# EAGLE design MBC3_1-3 (EAGLE 9.6.2)
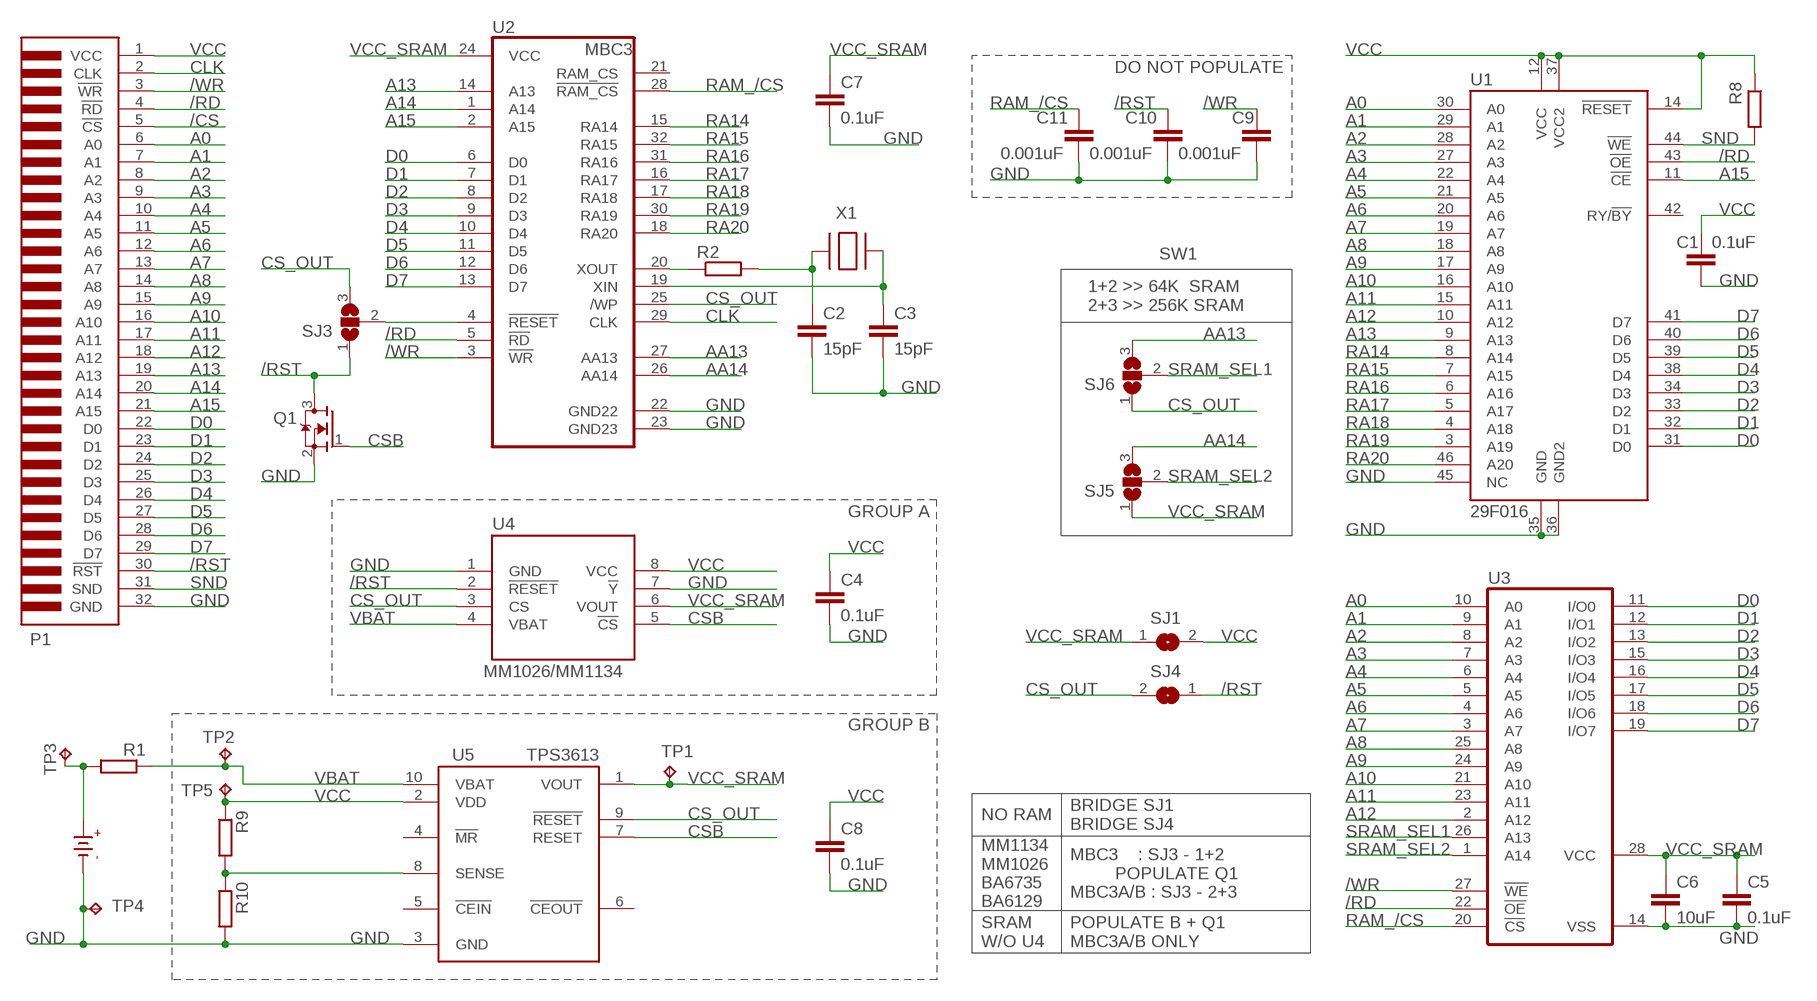
[diagram p0: schematic, sheet 1]

## Parts
B1  CR2025  [CR2025]
C1  0.1uF  C-EUC0603  [C0603]
C2  15pF  C-EUC0603  [C0603]
C3  15pF  C-EUC0603  [C0603]
C4  0.1uF  C-EUC0603  [C0603]
C5  0.1uF  C-EUC0603  [C0603]
C6  10uF  C-EUC0603  [C0603]
C7  0.1uF  C-EUC0603  [C0603]
C8  0.1uF  C-EUC0603  [C0603]
C9  0.001uF  C-EUC0603  [C0603]
C10  0.001uF  C-EUC0603  [C0603]
C11  0.001uF  C-EUC0603  [C0603]
P1  GBC_CART  [GBC_CART]
Q1  2N7002  MOSFET-NREFLOW  [SOT23]
R1  RR0603  [R0603]
R2  RR0603  [R0603]
R8  RR0603  [R0603]
R9  RR0603  [R0603]
R10  RR0603  [R0603]
SJ1  SJ  [SJ]
SJ3  SJ2W  [SJ_2]
SJ4  SJ  [SJ]
SJ5  SJ2W  [SJ_2]
SJ6  SJ2W  [SJ_2]
TP1  TPB1,27  [B1,27]
TP2  TPB1,27  [B1,27]
TP3  TPB1,27  [B1,27]
TP4  TPB1,27  [B1,27]
TP5  TPB1,27  [B1,27]
U1  29F016  [TSOP-48]
U2  MBC3  [QFP-32]
U3  62256_SRAM  [SOP-28L]
U4  MM1134  [SOIC-8]
U5  TPS3613  [MSOP-10]
X1  XTAL-3.2X1.5  [XTAL3215]

## Nets
/CS: P1.5(!CS)
/RD: P1.4(!RD) U1.43(!OE) U2.5(!RD) U3.22(!OE)
/RST: C10.1 P1.30(!RST) Q1.3(D) SJ3.1 SJ4.1 U4.2(!RESET)
/WR: C9.1 P1.3(!WR) U2.3(!WR) U3.27(!WE)
A0: P1.6(A0) U1.30(A0) U3.10(A0)
A1: P1.7(A1) U1.29(A1) U3.9(A1)
A2: P1.8(A2) U1.28(A2) U3.8(A2)
A3: P1.9(A3) U1.27(A3) U3.7(A3)
A4: P1.10(A4) U1.22(A4) U3.6(A4)
A5: P1.11(A5) U1.21(A5) U3.5(A5)
A6: P1.12(A6) U1.20(A6) U3.4(A6)
A7: P1.13(A7) U1.19(A7) U3.3(A7)
A8: P1.14(A8) U1.18(A8) U3.25(A8)
A9: P1.15(A9) U1.17(A9) U3.24(A9)
A10: P1.16(A10) U1.16(A10) U3.21(A10)
A11: P1.17(A11) U1.15(A11) U3.23(A11)
A12: P1.18(A12) U1.10(A12) U3.2(A12)
A13: P1.19(A13) U1.9(A13) U2.14(A13)
A14: P1.20(A14) U2.1(A14)
A15: P1.21(A15) U1.11(!CE) U2.2(A15)
AA13: SJ6.3 U2.27(AA13)
AA14: SJ5.3 U2.26(AA14)
CLK: P1.2(CLK) U2.29(CLK)
CS_OUT: SJ3.3 SJ4.2 SJ6.1 U2.25(/WP) U4.3(CS) U5.9(!RESET)
CSB: Q1.1(G) U4.5(!CS) U5.7(RESET)
D0: P1.22(D0) U1.31(D0) U2.6(D0) U3.11(I/O0)
D1: P1.23(D1) U1.32(D1) U2.7(D1) U3.12(I/O1)
D2: P1.24(D2) U1.33(D2) U2.8(D2) U3.13(I/O2)
D3: P1.25(D3) U1.34(D3) U2.9(D3) U3.15(I/O3)
D4: P1.26(D4) U1.38(D4) U2.10(D4) U3.16(I/O4)
D5: P1.27(D5) U1.39(D5) U2.11(D5) U3.17(I/O5)
D6: P1.28(D6) U1.40(D6) U2.12(D6) U3.18(I/O6)
D7: P1.29(D7) U1.41(D7) U2.13(D7) U3.19(I/O7)
GND [GND]: B1.- C1.2 C2.2 C3.2 C4.2 C5.2 C6.2 C7.2 C8.2 C9.2 C10.2 C11.2 P1.32(GND) Q1.2(S) R10.2 TP4.TP U1.35(GND) U1.36(GND2) U1.45(NC) U2.22(GND22) U2.23(GND23) U3.14(VSS) U4.1(GND) U4.7(!Y) U5.3(GND)
N$1: SJ3.2 U2.4(!RESET)
N$3 [VCC]: B1.+ R1.2 TP3.TP
N$6: R2.1 U2.20(XOUT)
N$7: C2.1 R2.2 X1.P$2
N$8: C3.1 U2.19(XIN) X1.P$1
N$10: R9.2 R10.1 U5.8(SENSE)
RA14: U1.8(A14) U2.15(RA14)
RA15: U1.7(A15) U2.32(RA15)
RA16: U1.6(A16) U2.31(RA16)
RA17: U1.5(A17) U2.16(RA17)
RA18: U1.4(A18) U2.17(RA18)
RA19: U1.3(A19) U2.30(RA19)
RA20: U1.46(A20) U2.18(RA20)
RAM_/CS: C11.1 U2.28(!RAM_CS) U3.20(!CS)
SND: P1.31(SND) R8.2 U1.44(!WE)
SRAM_SEL1: SJ6.2 U3.26(A13)
SRAM_SEL2: SJ5.2 U3.1(A14)
VBAT [VCC]: R1.1 TP2.TP U4.4(VBAT) U5.10(VBAT)
VCC [VCC]: C1.1 C4.1 C8.1 P1.1(VCC) R8.1 R9.1 SJ1.2 TP5.TP U1.12(VCC) U1.14(!RESET) U1.37(VCC2) U4.8(VCC) U5.2(VDD)
VCC_SRAM [VCC]: C5.1 C6.1 C7.1 SJ1.1 SJ5.1 TP1.TP U2.24(VCC) U3.28(VCC) U4.6(VOUT) U5.1(VOUT)
Unconnected: U1.42(RY/!BY) U2.21(RAM_CS) U5.4(!MR) U5.5(!CEIN) U5.6(!CEOUT)

## Notes on the sheet
- DO NOT POPULATE
- SW1
- 1+2 >> 64K  SRAM
  2+3 >> 256K SRAM
- GROUP A
- MM1026/MM1134
- GROUP B
- NO RAM
- BRIDGE SJ1
  BRIDGE SJ4
- MM1134
  MM1026
  BA6735
  BA6129
- MBC3    : SJ3 - 1+2
           POPULATE Q1
  MBC3A/B : SJ3 - 2+3
- SRAM
  W/O U4
- POPULATE B + Q1
  MBC3A/B ONLY

## Library data of the parts
B1 = gameboylib:CR2025
C1-C11 = rcl:C-EU: CAPACITOR, European symbol; SPICEPREFIX: C
P1 = gameboylib:GBC_CART
Q1 = adafruit:MOSFET-N: N-Channel Mosfet 2N7002E - 60V 260mA SOT23 [Digikey: 2N7002ET1GOSTR-ND] - REEL BSH103 - 30V 850mA SOT23 [Digikey: 568-5013-1-ND]
R1 R2 R8-R10 = eagle-ltspice:R: RESISTOR, European symbol; SPICEMODEL: NONE; SPICEPREFIX: R
SJ1 SJ4 = jumper:SJ: SMD solder JUMPER
SJ3 SJ5 SJ6 = jumper:SJ2W: SMD solder JUMPER
TP1-TP5 = testpad:TP: Test pad
U1 = gameboylib:29F016
U2 = gameboylib:MBC3: MBC3; OC_FARNELL: unknown; OC_NEWARK: unknown
U3 = gameboylib:62256_SRAM: MEMORY; MPN: CY62256VNLL-70SNXI; OC_FARNELL: 1650073; OC_NEWARK: 19M2582
U4 = gameboylib:MM1134
U5 = gameboylib:TPS3613
X1 = adafruit:XTAL: Low cost SMT crystals, no capacitors included http://www.ladyada.net/library/eagle

## Net classes
1 VCC: width 0.203 mm
2 GND: width 0.203 mm

## Board
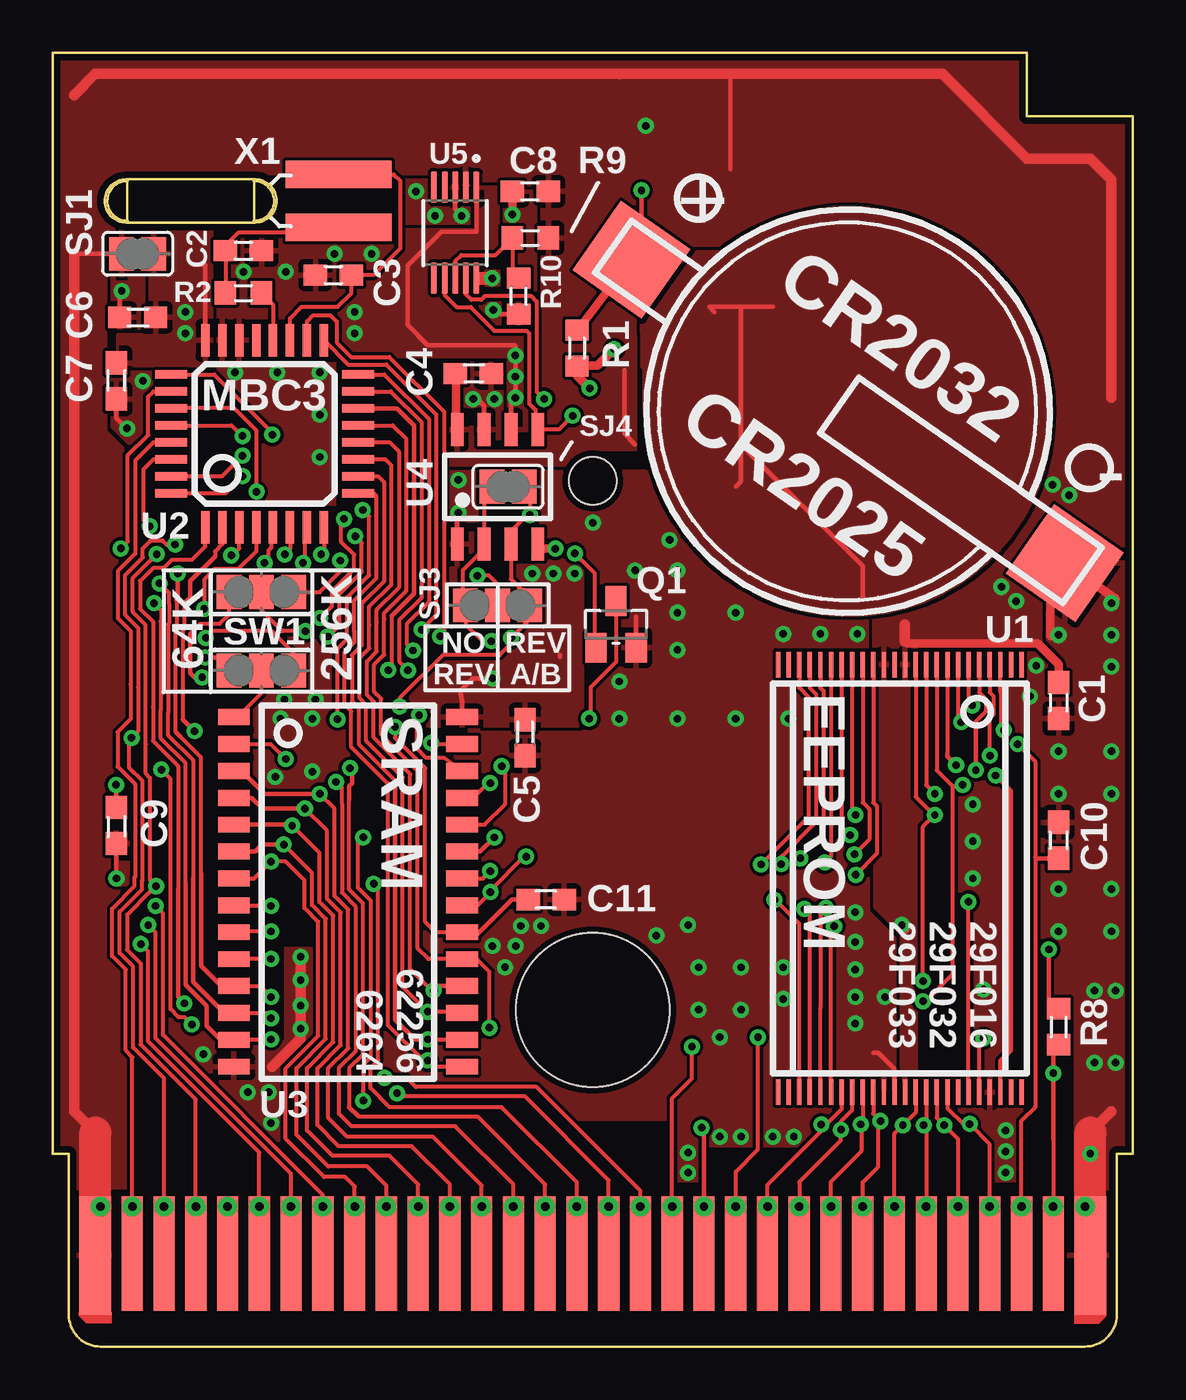
[diagram p1: board, top side]
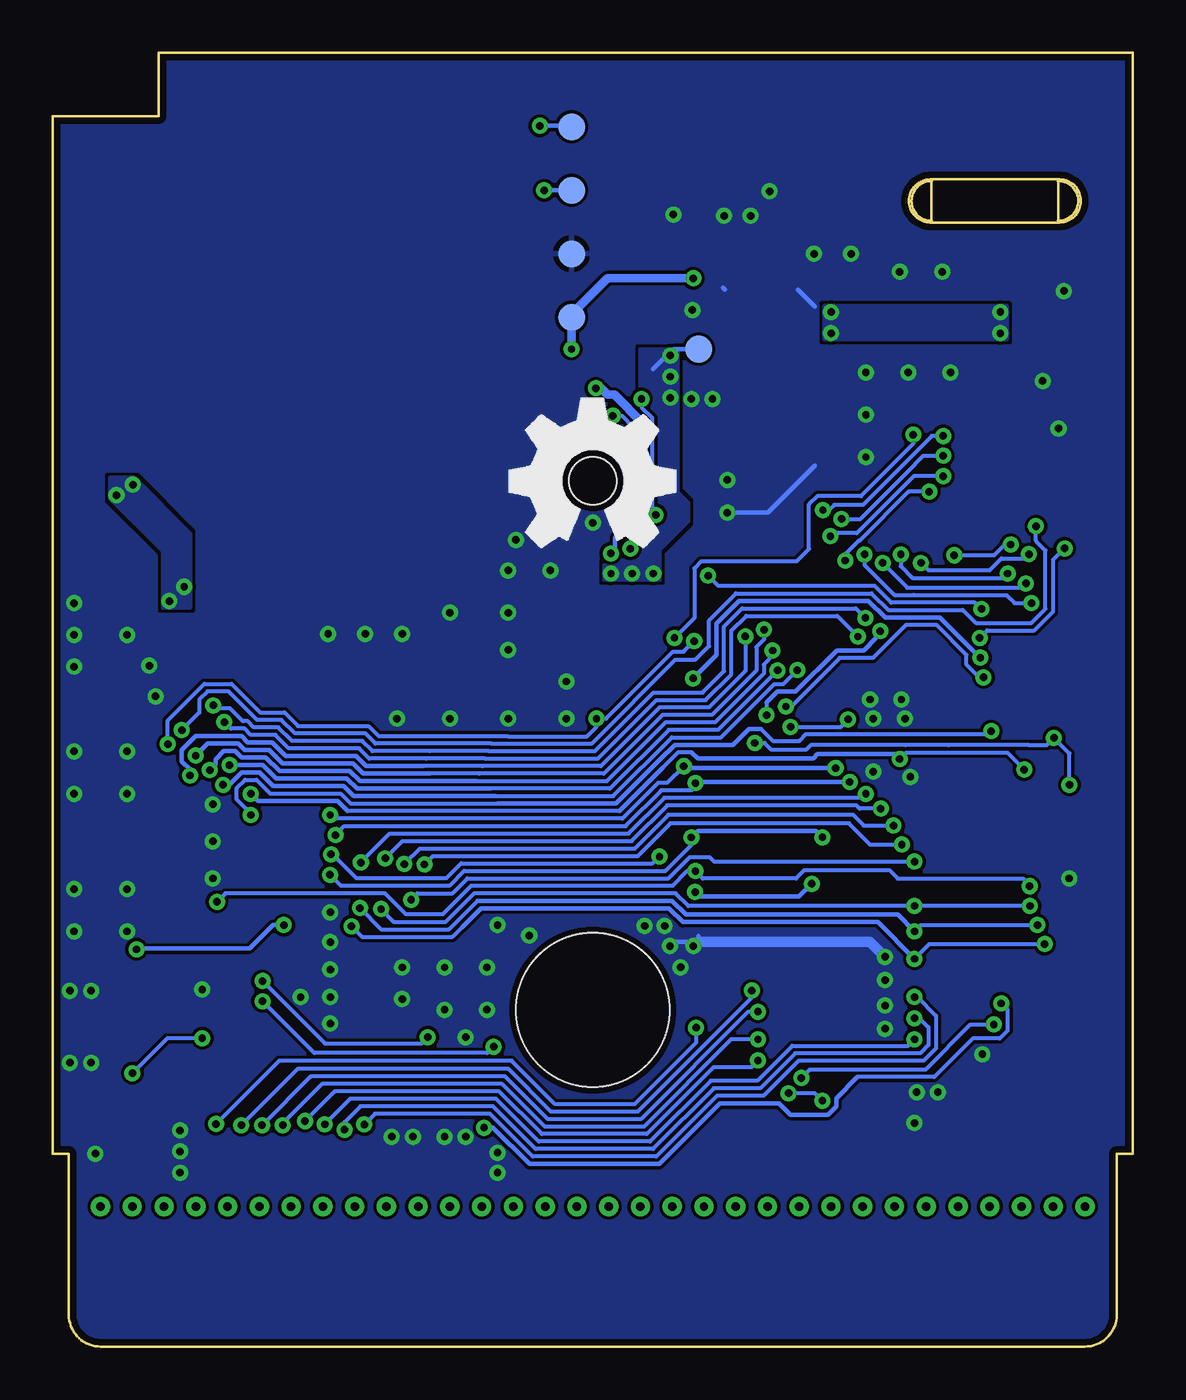
[diagram p2: board, bottom side, seen from below]

Size 51 x 61.1 mm. Coordinates in mm from the lower left corner, seen from the top.
Copper layers (1*16): Top 0.035mm / dielectric 1.5mm / Bottom 0.035mm
Design rules "default *": minimum track width 7mil, minimum drill 13mil, track to track 6mil, track to pad 7mil, pad to pad 7mil, via to via 7mil, smd to smd 5mil, copper to edge 12mil, drill to drill 22mil, minimum pad ring 10mil, minimum via ring 8mil, stop-mask expansion 4mil, vias tented up to drill 14mil, thermal gap 10mil
tKeepout: area -1.8,-1.5 to 54,11.1; area -1,11.1 to 2,62.1; area 49,11.1 to 52,62.1; area 2,55.2 to 49,62.1
tRestrict: area 30.8,8.8 to 35.4,9.3; area 47.4,5.6 to 48.1,15.7; area 10.2,14.5 to 10.8,20.8; area 9.6,21.1 to 10.3,22.5; area 46.6,0.8 to 49.9,1.3; area 9.5,39.1 to 13.5,39.6; area 13.5,39.6 to 14,46.6; area 9.1,46.6 to 13.5,47.1; area 8.3,46.6 to 8.5,48.4; area 9.1,48.2 to 10.9,48.4; area 26.6,6.8 to 33.9,7.7; area 37.8,11.3 to 42.4,12.1; area 34.1,32.4 to 38.8,32.9; area 45.1,31.5 to 45.9,32.1; area 34.1,31.5 to 34.9,32.1; area 34.1,12 to 39,12.7; area 10.8,19 to 12.2,19.7; area 25.6,41.6 to 27.9,42.2; area 25.6,41.5 to 28.1,41.7; area 24.2,10.1 to 28.9,10.6; area 44.6,7.3 to 45.4,7.7; area 2.5,24.5 to 3.1,24.8; area 8.7,29 to 9.4,29.2; area 8.7,27.7 to 9.4,28; area 20.8,42.5 to 21.2,42.7; area 22.1,42.5 to 22.4,42.7; area 19.5,44 to 19.9,44.2; area 19.5,38.6 to 19.9,38.8; area 22.1,37.1 to 22.5,37.3

### Footprints (pad centres in the part's own frame; a part is rotated, then mirrored left to right if it is on the bottom)
CR2025 = smd 4 x 4: + -12,0; - 13,0
C0603 = smd 1.1 x 1: 1 -0.85,0; 2 0.85,0
GBC_CART = smd 1.5 x 5.6: 1 -23.4,-25.01; 32 23.6,-25.01 | smd 1 x 5.4: 2 -21.65,-24.91; 3 -20.15,-24.91; 4 -18.65,-24.91; 5 -17.15,-24.91; 6 -15.65,-24.91; 7 -14.15,-24.91; 8 -12.65,-24.91; 9 -11.15,-24.91; 10 -9.65,-24.91; 11 -8.15,-24.91; 12 -6.65,-24.91; 13 -5.15,-24.91; 14 -3.65,-24.91; 15 -2.15,-24.91; 16 -0.65,-24.91; 17 0.85,-24.91; 18 2.35,-24.91; 19 3.85,-24.91; 20 5.35,-24.91; 21 6.85,-24.91; 22 8.35,-24.91; 23 9.85,-24.91; 24 11.35,-24.91; 25 12.85,-24.91; 26 14.35,-24.91; 27 15.85,-24.91; 28 17.35,-24.91; 29 18.85,-24.91; 30 20.35,-24.91; 31 21.85,-24.91 | drill 0.4: P$1 -21.65,-22.7; P$2 -18.65,-22.7; P$3 -15.65,-22.7; P$4 -12.65,-22.7; P$5 -9.65,-22.7; P$6 -6.65,-22.7; P$7 -3.65,-22.7; P$8 -0.65,-22.7; P$9 2.35,-22.7; P$10 5.35,-22.7; P$11 8.35,-22.7; P$12 11.35,-22.7; P$13 14.35,-22.7; P$14 17.35,-22.7; P$15 20.35,-22.7; P$16 23.35,-22.7; P$17 21.85,-22.7; P$18 18.85,-22.7; P$19 15.85,-22.7; P$20 12.85,-22.7; P$21 9.85,-22.7; P$22 6.85,-22.7; P$23 3.85,-22.7; P$24 0.85,-22.7; P$25 -2.15,-22.7; P$26 -5.15,-22.7; P$27 -8.15,-22.7; P$28 -11.15,-22.7; P$29 -14.15,-22.7; P$30 -17.15,-22.7; P$31 -20.15,-22.7; P$32 -23.15,-22.7 | hole 7.25: 0.1,-13.41 | hole 2.25: 0.1,11.585
SOT23 = smd 1 x 1.4: 1 -0.95,-1.1; 2 0.95,-1.1; 3 0,1.1
R0603 = smd 1 x 1.1: 1 -0.85,0; 2 0.85,0
SJ = smd 1.168 x 1.6: 1 -0.762,0; 2 0.762,0
SJ_2 = smd 1.168 x 1.6: 1 -1.524,0; 2 0,0; 3 1.524,0
B1,27 = smd 1.27 x 1.27: TP 0,0
TSOP-48 = smd 1.2 x 0.21: 1 -10.1,5.75; 2 -10.1,5.25; 3 -10.1,4.75; 4 -10.1,4.25; 5 -10.1,3.75; 6 -10.1,3.25; 7 -10.1,2.75; 8 -10.1,2.25; 9 -10.1,1.75; 10 -10.1,1.25; 11 -10.1,0.75; 12 -10.1,0.25; 13 -10.1,-0.25; 14 -10.1,-0.75; 15 -10.1,-1.25; 16 -10.1,-1.75; 17 -10.1,-2.25; 18 -10.1,-2.75; 19 -10.1,-3.25; 20 -10.1,-3.75; 21 -10.1,-4.25; 22 -10.1,-4.75; 23 -10.1,-5.25; 24 -10.1,-5.75; 25 10.1,-5.75; 26 10.1,-5.25; 27 10.1,-4.75; 28 10.1,-4.25; 29 10.1,-3.75; 30 10.1,-3.25; 31 10.1,-2.75; 32 10.1,-2.25; 33 10.1,-1.75; 34 10.1,-1.25; 35 10.1,-0.75; 36 10.1,-0.25; 37 10.1,0.25; 38 10.1,0.75; 39 10.1,1.25; 40 10.1,1.75; 41 10.1,2.25; 42 10.1,2.75; 43 10.1,3.25; 44 10.1,3.75; 45 10.1,4.25; 46 10.1,4.75; 47 10.1,5.25; 48 10.1,5.75
QFP-32 = smd 0.4 x 1.524: 1 -2.8,-4.415; 2 -2,-4.415; 3 -1.2,-4.415; 4 -0.4,-4.415; 5 0.4,-4.415; 6 1.2,-4.415; 7 2,-4.415; 8 2.8,-4.415; 17 2.8,4.415; 18 2,4.415; 19 1.2,4.415; 20 0.4,4.415; 21 -0.4,4.415; 22 -1.2,4.415; 23 -2,4.415; 24 -2.8,4.415 | smd 1.524 x 0.4: 9 4.415,-2.8; 10 4.415,-2; 11 4.415,-1.2; 12 4.415,-0.4; 13 4.415,0.4; 14 4.415,1.2; 15 4.415,2; 16 4.415,2.8; 25 -4.415,2.8; 26 -4.415,2; 27 -4.415,1.2; 28 -4.415,0.4; 29 -4.415,-0.4; 30 -4.415,-1.2; 31 -4.415,-2; 32 -4.415,-2.8
SOP-28L = smd 0.75 x 1.5: 1 -7.62,-5.457; 2 -6.35,-5.457; 3 -5.08,-5.457; 4 -3.81,-5.457; 5 -2.54,-5.457; 6 -1.27,-5.457; 7 0,-5.457; 8 1.27,-5.457; 9 2.54,-5.457; 10 3.81,-5.457; 11 5.08,-5.457; 12 6.35,-5.457; 13 7.62,-5.457; 14 8.89,-5.457; 15 8.89,5.33; 16 7.62,5.33; 17 6.35,5.33; 18 5.08,5.33; 19 3.81,5.33; 20 2.54,5.33; 21 1.27,5.33; 22 0,5.33; 23 -1.27,5.33; 24 -2.54,5.33; 25 -3.81,5.33; 26 -5.08,5.33; 27 -6.35,5.33; 28 -7.62,5.33
SOIC-8 = smd 0.6 x 1.55: 1 1.905,2.7; 2 0.635,2.7; 3 -0.635,2.7; 4 -1.905,2.7; 5 -1.905,-2.7; 6 -0.635,-2.7; 7 0.635,-2.7; 8 1.905,-2.7
MSOP-10 = smd 1.47 x 0.28: 1 -2.15,1; 2 -2.15,0.5; 3 -2.15,0; 4 -2.15,-0.5; 5 -2.15,-1; 6 2.15,-1; 7 2.15,-0.5; 8 2.15,0; 9 2.15,0.5; 10 2.15,1
XTAL3215 = smd 1.3 x 5: P$1 1.25,0.5; P$2 -1.25,0.5

### Placement (x,y rotation side)
B1  37.15,44.46 325 top
C1  47.5,30.51 270 top
C2  9,51.76 0 top
C3  13.25,50.61 180 top
C4  19.85,45.96 0 top
C5  22.3,28.76 270 top
C6  4,48.61 180 top
C7  3,45.61 270 top
C8  22.55,54.56 180 top
C9  3,24.61 270 top
C10  47.5,23.91 90 top
C11  23.3,21.11 0 top
P1  25.4,29.31 0 top
Q1  26.6,34.11 0 top
R1  24.75,47.16 90 top
R2  9,49.76 180 top
R8  47.5,15.11 270 top
R9  22.55,52.36 180 top
R10  22,49.61 270 top
SJ1  4,51.61 180 top
SJ3  21,35.01 0 top
SJ4  21.5,40.61 0 top
SJ5  9.85,31.93 0 top
SJ6  9.85,35.63 0 top
TP1  20.5,47.11 0 bottom
TP2  26.5,48.61 0 bottom
TP3  26.5,54.61 0 bottom
TP4  26.5,51.61 0 bottom
TP5  26.5,57.61 0 bottom
U1  40,22.11 270 top
U2  10,43.11 0 top
U3  14,22.11 270 top
U4  21,40.61 180 top
U5  19,52.61 270 top
X1  14,54.11 90 top

### Tracks (layer width: path | path; a pad name or v marks a point on that pad's centre or on a via)
/RD  (via drill 0.35)
  Top 0.2: P1.4 6.75,11.66 4.14,14.27 4.14,18.09 3.5,18.74 3.5,20.39 4.58,21.47 4.59,21.47 v4.87,21.74 4.58,22.03 4.58,26.86 4.38,27.06 4.38,28.45 4.37,28.46 4.37,30.98 4.38,30.99 4.38,34.09 3.77,34.7 3.77,36.3 4.58,37.12 4.6,37.12 v4.9,37.42 v4.89,37.43 | U3.22 20.3,22.11 v20.65,22.46 | U2.5 10.3,38.59 10.3,37.72 10.17,37.59 10.17,37.19 v9.99,37.02 | U1.43 v43.25,21.01
  Bottom 0.2: v4.87,21.74 4.87,21.81 5.17,22.11 11.1,22.11 11.5,22.51 15.5,22.51 15.9,22.11 20.3,22.11 v20.65,22.46 21.05,22.46 21.75,21.76 31.25,21.76 32.59,20.42 34.33,20.42 35.32,21.41 42.85,21.41 v43.25,21.01 | v4.9,37.42 5.1,37.22 6.2,37.22 6.75,36.67 9.64,36.67 v9.99,37.02
/RST  (via drill 0.35)
  Top 0.2: P1.30 45.75,10.67 46.39,11.31 46.39,23.12 46.39,27.63 v45.57,28.45 46.15,27.87 | v20.71,33.32 20.29,33.32 19.5,34.11 19.5,34.99 SJ3.1 19.35,35.14 19.35,36.66 20.36,37.67 U4.2 20.36,40.24 SJ4.1 | Q1.3 26.6,32.34 25.4,31.13 25.4,29.73 v25.32,29.65
  Top 0.203: C10.1 46.45,23.06 46.39,23.12
  Bottom 0.2: v45.57,28.45 45.57,29.57 43.85,31.3 42.56,31.3 41.22,29.95 40.06,29.95 39.42,29.31 36.1,29.31 35.62,28.83 29.52,28.83 29.51,28.82 25.78,28.82 25.32,29.27 v25.32,29.65 24.87,29.65 21.71,32.82 21.21,32.82 v20.71,33.32
/WR  (via drill 0.35)
  Top 0.2: v17.85,28.51 17.9,28.46 U3.27 | P1.3 5.25,12.67 3.79,14.13 3.79,17.95 3.15,18.59 3.15,20.53 4.21,21.6 4.21,22.02 4.23,22.03 4.23,26.72 3.61,27.34 3.61,28.65 v3.71,28.75 4.02,29.06 4.02,31.13 4.02,33.94 3.42,34.55 3.42,36.45 4.24,37.28 4.24,37.69 4.63,38.08 5.17,38.08 5.37,37.88 v5.76,37.88 | U2.3 8.8,37.7 8.45,37.35 v8.43,37.37
  Top 0.203: C9.1 2.98,25.48 v2.98,26.53
  Bottom 0.2: 17.85,28.46 v17.85,28.51 17.39,28.51 17.09,28.21 15.4,28.21 15.2,28.41 10.73,28.41 10.72,28.41 8.7,28.41 4.89,28.41 | v5.76,37.88 6.04,37.88 6.55,37.37 v8.43,37.37 | v2.98,26.53 2.98,28.02 v3.71,28.75 4.06,28.41 4.89,28.41 | 4.89,28.41
A0  (via drill 0.35)
  Top 0.2: P1.6 9.75,9.16 4.5,14.42 4.5,18.67 v4.16,19.01 | v10.3,18.31 8.8,18.31 U3.10 | v36.9,19.85 36.75,19.7 U1.30
  Bottom 0.2: v10.3,18.31 9.6,19.01 v4.16,19.01 | v36.9,19.85 36.4,19.35 32.13,19.35 31.69,19.8
  Bottom 0.203: v10.3,18.31 12.04,20.05 21.25,20.05 21.9,20.7 30.78,20.7 31.69,19.8
A1  (via drill 0.35)
  Top 0.2: v10.3,19.61 8.83,19.61 U3.9 | v36.5,20.71 36.24,20.45 36.24,15.98 36.25,15.98 U1.29 | P1.7 11.25,8.16 4.85,14.56 4.85,18.91 4.85,19.56 v4.5,19.91
  Bottom 0.2: v10.3,19.61 10,19.91 v4.5,19.91 | v36.5,20.71 35.5,19.71 32.3,19.71 30.95,21.06 30,21.06
  Bottom 0.203: v10.3,19.61 11.1,20.41 21.1,20.41 21.75,21.06 30,21.06 30.95,21.06
A2  (via drill 0.35)
  Top 0.2: P1.8 12.75,7.16 5.2,14.71 5.2,16.63 5.2,20.46 v4.85,20.81 | v10.3,20.81 8.82,20.81 U3.8 | v35.5,20.67 35.56,20.67 35.75,20.48 U1.28
  Bottom 0.2: v4.85,20.81 v10.3,20.81 20.98,20.81 21.58,21.41 31.1,21.41 32.44,20.07 34.9,20.07 v35.5,20.67
A3  (via drill 0.35)
  Top 0.2: P1.9 14.25,7.56 13.8,8.01 12.8,8.01 11,9.81 11,13.15 12.53,14.68 12.53,20.06 11.89,20.71 11.89,22.02 11,22.91 v10.3,22.91 9.5,22.11 U3.7 | v34.09,21.11 34.12,21.11 35.25,19.97 U1.27
  Bottom 0.2: v34.09,21.11 33.78,21.41 32.13,21.41 31.43,22.11 21.92,22.11 20.92,23.12 19.98,23.12 19.77,22.91 v10.3,22.91
A4  (via drill 0.35)
  Top 0.2: P1.10 15.75,7.6 14.84,8.51 13,8.51 11.5,10.01 11.5,13.15 12.89,14.53 12.89,20.21 12.24,20.85 12.24,22.37 v10.9,23.71 | v33.45,22.77 35.69,25.01 35.69,30.68 35.25,31.12 U1.22
  Top 0.203: U3.6 9.54,23.38 9.87,23.71 v10.9,23.71
  Bottom 0.2: 10.8,23.61 v10.9,23.71 12.4,23.71 13.4,24.71 21.83,24.71 23.37,23.17 33.05,23.17 v33.45,22.77
A5  (via drill 0.35)
  Top 0.2: P1.11 17.25,7.66 15.9,9.01 13.2,9.01 12,10.21 12,13.15 13.24,14.39 13.24,20.35 12.59,21 12.59,23.32 v11.3,24.61 | v34.41,22.79 34.41,23.14 36.05,24.77 36.05,30.82 35.75,31.12 U1.21
  Top 0.203: U3.5 11.26,24.65 v11.3,24.61
  Bottom 0.2: v11.3,24.61 12.7,24.61 13.2,25.11 21.93,25.11 23.52,23.52 33.67,23.52 v34.41,22.79
A6  (via drill 0.35)
  Top 0.2: P1.12 18.75,7.66 16.95,9.46 13.5,9.46 12.5,10.46 12.5,13.15 13.59,14.24 13.59,20.5 12.94,21.15 12.94,24.37 v11.9,25.41 | v35.31,23.06 35.31,23.16 36.4,24.25 36.4,30.97 36.25,31.11 U1.20
  Top 0.203: U3.4 9.39,25.92 9.9,25.41 v11.9,25.41
  Bottom 0.2: v11.9,25.41 12.9,25.41 13.06,25.57 21.97,25.57 23.66,23.88 34.49,23.88 v35.31,23.06
A7  (via drill 0.35)
  Top 0.2: P1.13 20.25,7.61 17.95,9.91 13.9,9.91 13,10.81 13,13.15 13.94,14.09 13.94,20.64 13.29,21.29 13.29,25.41 v12.6,26.11 | v36.46,22.86 36.75,23.15 U1.19
  Top 0.203: U3.3 8.92,27.19 10,26.11 v12.6,26.11
  Bottom 0.2: v12.6,26.11 12.79,25.92 22.12,25.92 23.81,24.23 35.09,24.23 v36.46,22.86
A8  (via drill 0.35)
  Top 0.2: P1.14 21.75,7.66 19,10.41 14.1,10.41 13.5,11.01 13.5,13.15 14.29,13.95 14.29,20.79 13.65,21.44 13.65,25.66 13.65,26.38 v13.37,26.67 | U3.25 19.85,25.92 20.55,26.62 v20.65,26.62 | v37.66,24.16 37.25,24.57 U1.18
  Bottom 0.2: 20,26.67 20.44,26.67 20.84,26.27 22.27,26.27 23.95,24.58 37.23,24.58 v37.66,24.16
  Bottom 0.203: v13.37,26.67 20,26.67 20.6,26.67 v20.65,26.62
A9  (via drill 0.35)
  Top 0.2: P1.15 23.25,7.66 20.05,10.86 14.45,10.86 | U3.24 20.39,24.65 21.35,25.61 21.35,27.26 v21.2,27.41 | 14,11.34 14,13.16 14.65,13.8 14.65,20.94 14,21.58 14,26.11 | v37.91,25.11 37.75,25.27 U1.17
  Top 0.203: 14,25.81 14,26.11 14,26.47 14.12,26.59 14.12,27.23 v14.03,27.32 | 14,11.34 14,11.31 14.45,10.86
  Bottom 0.2: v21.2,27.41 21.99,26.62 22.41,26.62 24.1,24.93 37.73,24.93 v37.91,25.11
  Bottom 0.203: v14.03,27.32 21.11,27.32 v21.2,27.41
A10  (via drill 0.35)
  Top 0.2: P1.16 24.75,7.76 21.2,11.31 15.9,11.31 15,12.21 15,13.16 15.36,13.52 15.36,21.65 v15.16,21.85 | U3.21 19.09,20.85 20.07,20.85 20.66,21.45 | v22.35,23.14 22.26,23.14 20.66,21.55 v20.66,21.47 | v37.86,23.25 38.56,23.95 38.56,25.38 38.25,25.69 U1.16
  Top 0.203: v20.66,21.47 20.66,21.45
  Bottom 0.2: v22.35,23.14 22.67,22.82 31.72,22.82 32.42,22.11 36.66,22.11 37.79,23.25 v37.86,23.25
  Bottom 0.203: v15.16,21.85 15.76,21.25 20.46,21.25 20.46,21.27 v20.66,21.47
A11  (via drill 0.35)
  Top 0.2: P1.17 26.25,7.86 22.3,11.81 16.41,11.81 v16.26,11.97 | v37.92,22.28 38.91,23.28 38.91,25.53 38.75,25.69 U1.15 | v14.66,24.05 14.66,24.03 14.4,23.78 14.4,21.68 15,21.08 15,13.66 14.65,13.3 14.65,12.06 14.66,12.06 v14.66,11.61
  Top 0.203: U3.23 20.19,23.38 v20.85,24.04
  Bottom 0.2: v14.66,11.61 15.01,11.97 v16.26,11.97 | v37.92,22.28 37.4,21.76 32.27,21.76 31.57,22.47 22.07,22.47 20.85,23.69 v20.85,24.04
  Bottom 0.203: v14.66,24.05 14.96,24.36 20.54,24.36 v20.85,24.04
A12  (via drill 0.35)
  Top 0.2: P1.18 27.75,7.36 22.85,12.26 17.13,12.26 16.7,12.69 v15.66,12.69 | U3.2 10.29,28.46 v11,27.75 | v41.66,26.11 41.25,26.52 U1.10 | v6.56,15.21 6.21,15.55 5.94,15.55 5.55,15.94 5.55,16.48 5.56,16.48 5.56,26.82 v5.12,27.25
  Bottom 0.2: v15.66,12.69 15.26,13.09 9.78,13.09 7.66,15.21 v6.56,15.21 | 11.23,27.98 v11,27.75 10.7,28.05 5.92,28.05 v5.12,27.25 | 22.18,27.36 21.47,28.07 20.83,28.07 | 24.25,25.29 37.08,25.29
  Bottom 0.203: 11.23,27.98 14.88,27.98 15.08,27.78 20.54,27.78 20.83,28.07 | 22.18,27.36 24.25,25.29 | v41.66,26.11 41.31,25.77 37.56,25.77 37.08,25.29
A13  (via drill 0.35)
  Top 0.2: P1.19 29.25,11.73 30.18,12.67 v30.18,14.17 | v41.1,16.31 41.23,16.31 42.51,17.59 42.51,26.45 41.75,27.22 U1.9 | 16,34.51 16,32.11 v15.84,31.95
  Top 0.203: 42.51,26.45 42.89,26.45 v42.97,26.53 | U2.14 16.25,44.31 17.05,43.51 17.05,35.56 16,34.51
  Bottom 0.2: v30.18,14.17 30.49,13.86 38.65,13.86 v41.1,16.31 | 30.1,26 29.85,26 24.54,26 21.77,28.78 19.44,28.78 16.93,31.29 16.5,31.29 v15.84,31.95
  Bottom 0.203: v42.97,26.53 42.66,26.53 42.07,27.12 41.24,27.12 40.59,26.48 37.27,26.48 36.79,26 30.1,26
A14  (via drill 0.35)
  Top 0.2: 5.91,16.51 v6.21,16.21 | 5.91,21.64 5.91,27.42 4.72,28.6 4.72,30.2 4.73,30.2 4.73,34.24 4.12,34.84 4.12,36.16 4.73,36.77 5.23,36.77 5.63,37.17 6.57,37.17 7.2,37.8 U2.1
  Top 0.203: P1.20 30.75,10.22 v30.64,10.34 | 5.91,16.51 5.91,21.64
  Bottom 0.2: 13,12.73 9.38,12.73 7.56,14.55 6.28,14.55 5.9,14.94 5.9,15.9 v6.21,16.21
  Bottom 0.203: v30.64,10.34 30.61,10.36 30.23,10.36 28.49,8.62 22.36,8.62 19.49,11.49 16.71,11.49 16.17,10.95 14.38,10.95 14,11.34 14,11.73 13,12.73
A15  (via drill 0.35)
  Top 0.2: P1.21 32.25,8.26 33.3,9.31 v33.3,14.61 | 41.6,25.11 40.75,25.96 U1.11 | 41.6,25.11 41.6,25.06 41.1,24.56 v41.1,17.26 | 41.6,25.11 v41.66,25.11 | U2.2 8,37.9 7.66,37.55 7.66,37.34 | 6.49,35.41 6.19,35.11 6.19,33.87 6.14,33.82 6.14,29.62 6.14,29.61
  Top 0.203: 7.66,37.34 7.66,37.32 6.49,36.15 6.49,35.41 | 6.14,29.61 v6.69,29.07
  Bottom 0.2: v41.1,17.26 38.15,14.31 33.6,14.31 v33.3,14.61 | v41.66,25.11 41.66,25.18 42.31,25.84 42.31,26.38 41.93,26.77 41.38,26.77 40.74,26.12 37.42,26.12 36.94,25.64 30,25.64 | 17.55,29.17 17,28.61 15.74,28.61 15.44,28.92 6.83,28.92 v6.69,29.07
  Bottom 0.203: 17.55,29.17 18.12,29.17 18.87,28.42 21.62,28.42 22.32,27.72 24.4,25.64 29.7,25.64 30,25.64
AA13  (via drill 0.35)
  Top 0.2: v13.57,37.12 13.57,36.61 12.6,35.63 SJ6.3 | U2.27 8.57,44.32 9.61,43.28 v9.61,40.38 v9.61,40.37
  Bottom 0.2: v9.61,40.37 10.58,40.37 12.89,38.07 12.94,38.07 13.57,37.43 v13.57,37.12
AA14  (via drill 0.35)
  Top 0.2: SJ5.3 11.36,31.95 11.36,32.76 10.33,33.79 7.53,33.79 v7.22,33.48 | U2.26 4.75,45.11 4.5,44.86 4.5,43.06 3.54,42.1 3.54,38.02 v3.21,37.7
  Bottom 0.2: v7.22,33.48 6.87,33.83 4.64,33.83 3.76,34.7 3.76,37.14 v3.21,37.7
CLK
  Top 0.2: P1.2 3.75,13.67 3.44,13.98 3.44,17.8 2.79,18.45 2.79,20.68 3.86,21.75 3.86,22.16 3.88,22.18 3.88,26.57 3.06,27.39 3.06,29.02 3.67,29.64 3.67,31.27 3.67,31.28 3.67,33.8 3.06,34.41 3.06,36.62 3.89,37.45 3.89,41.85 4.75,42.71 U2.29
CS_OUT  (via drill 0.35)
  Top 0.2: 21.64,38.51 U4.3 | 22.52,35.44 22.52,35.36 | 22.52,35.36 SJ3.3 22.52,34.36 v21.64,33.48 21.64,33.21 21.1,32.66 18.42,32.66 16.38,30.62 v16.38,30.23 | U2.25 7.63,45.91 10.36,43.17 v10.36,43.07 | U4.3 21.64,38.52 22.43,39.32 22.43,39.36 22.45,39.36 v22.53,39.28 22.53,40.34 SJ4.2 | v23.2,44.76 22.85,45.11 22.85,49.36 22.6,49.61 20.4,49.61 20.23,49.45 19.77,49.45 19.5,49.71 U5.9 | U4.3 21.64,36.25 22.52,35.36 | 6.49,33.53 6.49,33.67 6.96,34.14 7.88,34.14 8.33,34.59 8.33,35.36
  Top 0.203: 8.33,35.36 SJ6.1 | 6.49,33.53 6.49,31.81 6.7,31.61 v7.05,31.61
  Bottom 0.2: v10.36,43.07 10.36,42.64 12.83,40.17 14.9,40.17 15.29,39.78 15.29,37.67 15.88,37.08 20.38,37.08 20.71,36.75 20.71,34.41 v21.64,33.48 | v7.05,31.61 7.25,31.61 7.85,32.21 7.85,32.67 9.26,34.08 10.71,34.08 12.27,32.52 13.83,32.52 16.12,30.23 v16.38,30.23 | v22.53,39.28 22.69,39.44 22.69,43.85 23.2,44.36 v23.2,44.76
CSB  (via drill 0.35)
  Top 0.2: Q1.1 25.57,33.09 25.57,36.53 v24.65,37.46 | v24.55,43.96 23.9,43.31 U4.5 22.8,43.31 22.8,44.23 22.5,44.53 22.5,47.86 22.38,47.98 20.84,47.98 19.73,49.09 19.07,49.09 18.5,49.66 U5.7
  Bottom 0.2: v24.55,43.96 24.13,43.96 23.6,43.43 23.6,40.06
  Bottom 0.203: v24.65,37.46 24.45,37.66 24.45,38.21 24.1,38.56 24.1,39.56 23.6,40.06
D0  (via drill 0.35)
  Top 0.2: U3.11 9.78,17.03 v10.3,16.51 | P1.22 33.75,7.65 36.29,10.19 v36.29,10.49 36.53,10.49 37.25,11.21 U1.31 | 7,22.11 7,27.82 6.03,28.8 | U2.6 11.2,37.66 v10.95,37.41 | v5.9,36.51 5.99,36.42 | 5.84,35.27 5.84,35.26 5.84,34.02 5.79,33.97 5.79,29.77 5.78,29.76 5.78,29.04 5.83,29
  Top 0.203: U3.11 7.95,17.03 7,17.98 7,22.11 7,22.35 | v5.9,36.51 5.9,35.33 5.84,35.27 5.83,35.26 | 5.83,29 6.03,28.8
  Bottom 0.2: v10.3,16.51 10.17,16.51 9.29,15.63 9.29,14.09 9.88,13.5 15.78,13.5 17.44,11.85 19.63,11.85 22.5,8.98 28.35,8.98 30.36,11 35.79,11 v36.29,10.49 | v10.95,37.41 10.95,36.86 10.4,36.31 6.1,36.31 v5.9,36.51
D1  (via drill 0.35)
  Top 0.2: U3.12 10.05,15.76 v10.3,15.51 | P1.23 35.25,7.77 37.2,9.72 37.2,10.22 v37.23,10.24 37.23,10.64 37.75,11.16 U1.32 | 6.62,22.11 6.62,27.7 5.43,28.89 5.43,29.91 5.43,34.12 5.48,34.16 5.48,35.1 5.48,35.11 5.48,35.61 v5.04,36.05 | v11.81,37.01 11.9,37.01 11.9,38.59 U2.7
  Top 0.203: U3.12 8.09,15.76 6.62,17.23 6.62,22.11 6.62,22.13
  Bottom 0.2: v10.3,15.51 10.07,15.51 9.64,15.08 9.64,14.24 10.03,13.85 15.93,13.85 17.58,12.2 19.78,12.2 22.65,9.33 28.2,9.33 30.22,11.35 36.47,11.35 37.23,10.59 v37.23,10.24 | v11.81,37.01 10.65,35.85 5.34,35.85 5.14,36.05 v5.04,36.05
D2  (via drill 0.35)
  Top 0.2: P1.24 36.75,7.79 38.18,9.22 38.18,10.47 v38.16,10.5 38.25,10.59 U1.33 | U3.13 10.28,14.49 v10.3,14.51 | 6.26,21.88 6.26,27.56 5.08,28.75 5.08,30.05 5.08,30.06 5.08,34.26 5.12,34.3 5.12,34.77 v4.78,35.12 | U2.8 12.8,37.54 v12.67,37.41
  Top 0.203: U3.13 7.92,14.49 7.27,15.14 7.27,16.08 6.26,17.08 6.26,21.88
  Bottom 0.2: v10.3,14.51 10.6,14.21 16.07,14.21 17.73,12.55 19.93,12.55 22.8,9.68 28.05,9.68 30.07,11.7 36.96,11.7 v38.16,10.5 | v4.78,35.12 5.58,35.12 5.96,35.49 10.35,35.49 10.35,35.5 11.24,35.5 12.67,36.92 v12.67,37.41
D3  (via drill 0.35)
  Top 0.2: U3.15 17.99,13.22 v17.7,13.51 | P1.25 38.25,7.76 38.97,8.47 38.97,10.52 v39.09,10.65 38.75,10.99 U1.34 | 17.5,13.51 15.81,15.2 15.81,26.6 14.1,28.32 14.1,30.02 13.77,30.34 13.77,32.8 14.24,33.27 14.24,33.78 14.24,35.24 15.29,36.29 15.29,40.16 15.14,40.31 U2.9
  Top 0.203: v17.7,13.51 17.5,13.51
  Bottom 0.2: v17.7,13.51 18,13.21 19.77,13.21 22.94,10.04 27.91,10.04 29.93,12.05 37.69,12.05 v39.09,10.65
D4  (via drill 0.35)
  Top 0.2: U3.16 17.72,14.49 v17.7,14.51 | P1.26 39.75,10.06 v40.14,10.45 v40.15,10.45 40.75,11.06 U1.38 | U2.10 15.35,41.11 15.64,40.82 15.64,36.14 14.59,35.09 14.59,33.92 14.59,33.12 14.12,32.66 14.12,30.49 14.45,30.16 14.45,28.46 16.17,26.74
  Top 0.203: v17.7,14.51 17.1,14.51 16.17,15.44 16.17,26.74
  Bottom 0.2: v17.7,14.51 18.97,14.51 23.09,10.39 27.76,10.39 29.78,12.4 38.29,12.4 40.15,10.55 v40.15,10.45
D5  (via drill 0.35)
  Top 0.2: U3.17 19.03,15.81 v17.7,15.81 16.52,16.99 16.52,26.89 14.8,28.61 14.8,30.31 14.48,30.63 14.48,32.51 14.94,32.98 14.94,34.07 14.94,34.95 15.99,36 15.99,41.61 15.69,41.91 U2.11 | P1.27 41.25,10.33 v41.13,10.45 41.25,10.57 U1.39
  Bottom 0.2: v17.7,15.81 18.16,15.81 23.23,10.74 27.62,10.74 29.63,12.76 38.83,12.76 v41.13,10.45
D6  (via drill 0.35)
  Top 0.2: v17.99,16.82 18.19,17.02 U3.18 17.68,17.03 16.88,17.83 16.88,27.03 15.15,28.76 15.15,30.46 14.83,30.78 14.83,32.37 15.29,32.83 15.29,34.22 15.29,34.8 16.34,35.85 16.34,42.26 15.89,42.71 U2.12 | P1.28 42.75,9.8 v42.1,10.45 41.75,10.8 U1.40
  Bottom 0.2: v17.99,16.82 17.99,16.48 23.38,11.09 27.47,11.09 29.49,13.11 39.44,13.11 v42.1,10.45
D7  (via drill 0.35)
  Top 0.2: P1.29 44.25,5 44.23,5.02 44.23,9.58 v43.3,10.51 43,10.51 42.25,11.26 U1.41 | v20.62,15.05 20.62,17.7 20.02,18.3 U3.19 17.74,18.3 17.23,18.81 17.23,27.18 15.51,28.9 15.51,30.6 15.18,30.93 15.18,32.22 15.65,32.69 15.65,34.36 15.65,34.66 16.7,35.71 16.7,42.86 16.05,43.51 U2.13
  Bottom 0.2: v20.62,15.05 20.62,14.35 23.52,11.45 27.28,11.45 29.33,13.49 40.31,13.49 v43.3,10.51
GND  (via drill 0.35)
  Top 0.203: U4.1 19.09,39.38 v19.15,39.38 | C9.2 v3,22.11 | 27.55,34.48 Q1.2 | C6.2 3.15,49.76 v3.25,49.86 | R10.2 20.99,48.76 v20.8,48.95 | U4.7 20.36,44.45 20.05,44.76 v19.85,44.76 | U5.3 19,53.71 v19.3,53.41 | v3.5,43.36 3,43.86 C7.2 | U1.36 39.75,13.11 39,13.86 38.75,13.86
  Top 0.4: 50.2,35.31 B1.- 47.1,35.51 47.1,33.56 | C8.2 v21.7,53.47
  Top 0.5: 49,10.11 50,11.11 | v11.7,18.41 11.7,14.56 10.36,13.22
  Top 1.5: P1.32 49,10.11
  Bottom 0.203: 20.5,19.4 20.5,19.11 21.86,19.11 v21.86,18.92 | v19.15,39.38 17.23,39.38 15,41.61 | 15,49.11 15.8,49.91 | 19.25,49.91 19.35,50.01
  Bottom 0.5: v11.7,18.41 12.4,19.11 20.5,19.11
  other vias: 11.7,17.31 11.7,16.11 11.7,15.01 7.1,13.81 9.2,12.01 10.2,12.01 10.3,10.56 28.5,19.41 30,19.91 30.5,17.91 30.5,15.91 32.5,15.91 32.5,17.91 34.5,17.91 31.5,9.91 32.5,9.91 50.2,16.81 50.2,13.41 49,9.11 49.2,13.41 49.2,16.81 37.9,17.81 37.9,16.51 37.9,19.11 37.9,20.51 39.3,16.51 22.11,19.87 19.15,40.94 8.6,46.01 10.6,46.01 12.6,46.01 12.6,44.01 12.6,42.01 31.5,14.61 34.5,16.41 50,28.11 47.5,28.11 47.5,21.61 34,9.91 35,9.91 30,8.21 30,9.16 25.5,38.91 50,35.11 47.5,33.61 50,32.11 50,33.61 50,26.11 47.5,26.11 50,21.61 50,19.61 47.5,19.61 46.15,30.71 46.45,32.16 20.76,18.92 9,50.76 11,50.76 13.3,51.61 15.05,51.61 4.25,45.61 37.9,15.26 43.95,16.86 43.45,22.11 43.45,25.61 43.45,23.86 12.25,29.66 12.25,27.16 10.5,26.91 10.93,30.56 12.4,30.56 23.06,19.87 21.36,17.92 17.15,54.56 18.05,53.41 20.85,44.76 26.75,31.41 26.75,29.66 29.5,29.66 34.75,29.66 32.25,29.66 32.25,34.66 38,33.66 36.25,33.66 34.5,33.66 29.5,34.66 29.5,32.91 27.5,36.66 29.13,38.1 29.5,36.66 10.75,29.66 45,8.21 45,9.21 45,10.21
  pour Bottom (rank 4): -2,63.11 54,63.11 54,-2.89 -5,-2.89 -5,60.11
  pour Top (rank 6): -2.5,64.11 53.5,64.11 53.5,-3.39 -3.5,-3.39 -3.5,63.11
  pour Top (rank 2): 38.45,33.11 38.45,34.21 37.3,34.21 37.3,33.11
N$1  (via drill 0.35)
  Top 0.2: U2.4 9.6,37.56 8.75,36.71 7.63,36.71 7.14,36.23 v7.14,34.84 | v20.05,36.41 20.6,36.41 21,36.01 SJ3.2
  Bottom 0.2: 7.37,35.07 v7.14,34.84 7.45,35.14 11.4,35.14 12.19,35.93 19.57,35.93 v20.05,36.41
N$3  (via drill 0.35)
  Top 0.203: v27.8,54.61 27.8,52.36 26.55,51.11 27.09,51.11 B1.+ | B1.+ 27.09,51.11 27.09,51.04 | B1.+ 27.54,51.57 | B1.+ 28.77,51.34 | 31.25,48.86 31,49.11 32.5,49.11 | 32.5,49.11 34,49.11 | 32.5,49.11 32.5,42.61 | 32.5,42.61 32.5,40.86 32.25,40.61 | 32.5,42.61 38.25,36.86 38.25,35.36
  Top 0.4: 27.54,51.57 27.6,51.62 | 27.09,51.04 26,49.61 24.9,48.14 24.88,48.14 R1.2
  Bottom 0.203: 26.5,54.11 TP3.TP v27.8,54.61
  pour Top (rank 5): 32.5,54.61 41.5,54.61 47.75,48.36 47.75,39.11 43,34.36 39.75,34.36 27.75,46.36 27.75,49.86
  pour Top: 29.9,51.76 29.95,51.71 31.85,51.71 31.85,44.31 27.95,44.31 27.95,51.76
  pour Top: 27.95,44.21 arc90 37.6,34.56 37.65,34.56 37.65,39.96 35.75,41.86 33.25,44.36 28.25,44.36 28.05,44.36 27.95,44.26
  pour Top: 37.7,34.56 arc90 47.15,44.01 43.15,44.01 43,43.86 37.7,38.56
N$6
  Top 0.2: R2.1 10.4,49.21 U2.20
N$7
  Top 0.2: R2.2 C2.1 8.15,52.01 8.75,52.61 13.25,52.61 X1.P$2
N$8
  Top 0.2: U2.19 11.2,48.56 11.75,49.11 13.45,49.11 14.1,49.76 C3.1 15.15,50.61 16.4,51.86 16.4,55.06 16.1,55.36 X1.P$1
N$10
  Top 0.2: R10.1 21.7,50.76 21.7,52.26 | R9.2 20.9,51.56 19.3,51.56 19,51.26 U5.8
  Top 0.203: R9.2 21.7,52.26
RA14  (via drill 0.35)
  Top 0.2: U2.15 15.95,45.11 17.4,43.66 17.4,35.36 16.35,34.31 16.35,32.36 v16.77,31.94 | U1.8 42.25,28.04
  Top 0.203: 42.25,28.04 42.25,27.87 v42.66,27.46
  Bottom 0.2: 30.35,26.35 24.69,26.35 21.91,29.13 19.58,29.13 v16.77,31.94
  Bottom 0.203: v42.66,27.46 42.23,27.46 42.22,27.48 41.09,27.48 40.45,26.83 37.12,26.83 36.64,26.35 30.35,26.35
RA15  (via drill 0.35)
  Top 0.2: v42.91,29.49 42.75,29.65 U1.7 | v12.98,33.53 13.53,34.09 13.53,35.53 14.58,36.58 14.58,37.97 v14.28,38.28 | 5.62,40.28 U2.32 8.15,40.31 v8.95,41.11
  Bottom 0.2: v42.91,29.49 42.6,29.19 41.95,29.19 41.66,28.9 40.5,28.9 39.86,28.25 36.53,28.25 36.05,27.77 33.35,27.77 30.57,27.77 30.56,27.76 25.27,27.76 22.5,30.54 20.17,30.54 18.95,31.75 18.95,33.81 18.25,34.52 13.96,34.52 v12.98,33.53 | v14.28,38.28 14.13,38.42 13.04,38.42 10.34,41.11 v8.95,41.11
RA16  (via drill 0.35)
  Top 0.2: v43.43,30.29 43.25,30.47 U1.6 | v12.63,34.42 13.18,34.97 13.18,35.68 14.23,36.73 14.23,37.4 13.62,38 13.62,38.95 13.75,39.08 v13.75,39.09 | U2.31 7.98,41.11 v8.95,42.08
  Bottom 0.2: v43.43,30.29 43.28,30.15 42.63,30.15 42.03,29.54 41.8,29.54 41.51,29.25 40.36,29.25 39.71,28.6 36.39,28.6 35.91,28.12 33.21,28.12 30.42,28.12 30.41,28.12 25.41,28.12 22.64,30.89 20.31,30.89 19.3,31.9 19.3,34.01 18.45,34.87 13.07,34.87 v12.63,34.42 | v13.75,39.09 12.86,39.09 10.27,41.69 9.88,42.08 v8.95,42.08
RA17  (via drill 0.35)
  Top 0.2: 43.59,29.11 43.59,29.53 44.08,30.02 44.08,30.56 43.75,30.89 U1.5 | U2.16 15.65,45.91 17.76,43.8 17.76,35.17 16.71,34.12 16.71,33.17 v17.01,32.88
  Top 0.203: 43.59,29.17 43.59,29.11 v43.59,27.22
  Bottom 0.2: 31,26.71 24.83,26.71 22.06,29.48 19.73,29.48 17.43,31.78 17.43,32.21 17.01,32.63 v17.01,32.88
  Bottom 0.203: v43.59,27.22 43.32,27.5 43.32,27.74 42.93,28.12 42.39,28.12 42.1,27.83 40.94,27.83 40.3,27.19 36.98,27.19 36.5,26.71 31,26.71
RA18  (via drill 0.35)
  Top 0.2: v44.26,27.91 44.26,29.69 44.44,29.87 44.44,30.71 44.25,30.89 U1.4 | U2.17 13.94,46.39 15.74,46.39 18.11,44.02 18.11,34.55 v17.41,33.86
  Bottom 0.2: 33.2,27.06 30.86,27.06 30.85,27.06 24.98,27.06 22.2,29.83 19.88,29.83 17.78,31.93 17.78,33.03 17.41,33.4 v17.41,33.86
  Bottom 0.203: v44.26,27.91 43.69,28.48 42.24,28.48 41.95,28.19 40.8,28.19 40.15,27.54 36.83,27.54 36.35,27.06 33.2,27.06
RA19  (via drill 0.35)
  Top 0.2: v44.91,29.11 44.79,29.24 44.79,30.85 44.75,30.89 U1.3 | v4.57,38.75 4.27,39.05 4.27,41.43 4.75,41.91 U2.30
  Bottom 0.2: v44.91,29.11 44.08,29.94 44.08,30.56 43.7,30.95 42.71,30.95 41.36,29.6 40.21,29.6 39.56,28.96 36.24,28.96 35.76,28.48 30.28,28.48 30.27,28.47 25.56,28.47 21.59,32.44 20.66,32.44 20.01,33.09 20.01,34.3 18.74,35.58 12.33,35.58 11.54,34.79 8.02,34.79 7.42,34.18 4.78,34.18 4.12,34.84 4.12,37.6 4.57,38.05 v4.57,38.75
RA20  (via drill 0.35)
  Top 0.2: U2.18 12,48.41 12.3,48.71 13.1,48.71 13.4,48.41 13.4,47.42 14.08,46.74 15.89,46.74 18.47,44.16 18.47,33.71 v18.3,33.54 | U1.46 44.75,13.5
  Top 0.203: 44.75,13.5 45.25,14 45.25,26.25 v44.53,26.97
  Bottom 0.2: 33.5,27.42 30.71,27.42 30.71,27.41 25.12,27.41 22.35,30.18 20.02,30.18 18.3,31.91 v18.3,33.54
  Bottom 0.203: v44.53,26.97 44.53,27.25 44.91,27.63 44.91,28.18 44.26,28.83 42.09,28.83 41.8,28.54 40.65,28.54 40,27.9 36.68,27.9 36.2,27.42 33.5,27.42
RAM_/CS  (via drill 0.35)
  Top 0.2: U3.20 18.07,19.57 17.58,20.06 17.58,27.32 16.16,28.75 v16.16,29.27 | v13.44,29.63 13.42,29.65 13.42,32.95 13.89,33.41 13.89,33.63 13.88,33.63 13.88,35.39 14.93,36.44 14.93,39.21 v14.63,39.51 | v8.95,43.01 8.94,43.01 8.44,43.51 U2.28
  Top 0.203: U3.20 19.94,19.57 20.04,19.47 21.68,21.11 C11.1
  Bottom 0.2: v16.16,29.27 13.79,29.27 v13.44,29.63 | v14.63,39.51 14.34,39.51 14.1,39.75 12.75,39.75 9.49,43.01 v8.95,43.01
SND  (via drill 0.35)
  Top 0.2: 47.25,9.81 P1.31 | v43.95,14.56 v43.95,14.55 43.75,14.35 U1.44
  Top 0.203: R8.2 47.25,14.26 v47.25,12.91 47.25,9.81
  Bottom 0.2: v43.95,14.56 45.6,14.56 v47.25,12.91
SRAM_SEL1  (via drill 0.35)
  Top 0.2: U3.26 18.47,27.8 17.63,27.8 17.19,28.24 17.19,29.68 17.3,29.78 v17.3,29.82 | v11.93,33.79 10.82,33.79 9.85,34.77 SJ6.2
  Bottom 0.2: 17.3,30.42 v17.3,29.82
  Bottom 0.203: v11.93,33.79 12.12,33.6 12.12,33.46 12.71,32.88 13.98,32.88 15.92,30.93 16.78,30.93 17.3,30.42
SRAM_SEL2
  Top 0.2: SJ5.2 9.82,31.91 9.82,30.84 8.72,29.73 U3.1
VBAT  (via drill 0.35)
  Top 0.203: 24.75,46.34 R1.1 | U5.10 v20.75,50.46 | U5.10 20.02,50.48 20.02,50.66 20.8,50.66 | U5.10 20,50.26 | 20,50.26 20,49.96 | 20,50.26 20.77,50.26
  Top 0.4: v26.51,47.11 25.73,46.34 24.75,46.34 | v25.36,45.26 24.75,45.87 R1.1 | v23.73,37.68 23.14,37.68 U4.4
  Bottom 0.203: TP2.TP v26.51,47.11
  Bottom 0.4: v25.36,45.26 25.11,45.26 24.8,44.96 24.48,44.96 23.14,43.62 23.14,39.88 23.6,39.42 23.6,37.81 v23.73,37.68 | v20.75,50.46 24.81,50.46 26.51,48.76 v26.51,47.11
  pour Top: 20,50.76 20,50.16 21.07,50.16 21.07,50.76
VCC  (via drill 0.35)
  Top 0.203: R8.1 47.15,15.96 47.05,16.06 v47.05,18.76 | 40.1,33.61 40.25,33.46 | SJ1.2 1,51.61 | 32,60.11 32,55.61 | 27.5,42.61 27,43.11 27,46.11
  Top 0.4: 26.76,60.05 26.7,60.11 | 40.25,33.31 40.36,33.2 46.51,33.2 47.5,32.21 C1.1 | U4.8 19.05,43.36 19.05,45.91 C4.1
  Top 0.5: 2,10.11 1,11.11 1,51.61 | 1,59.11 2,60.11 26.7,60.11 32,60.11 42,60.11 46,56.11 49,56.11 50,55.11 50,44.81 | 40.25,34.11 40.25,33.46 40.25,33.31 | v40.1,19.91 40.25,19.76
  Top 1.5: P1.1 2,10.11
  Bottom 0.203: v47.05,18.76 47,18.81 41.7,18.81 40.6,19.91 v40.1,19.91 | TP5.TP 26.55,57.66 v28,57.66
  other vias: 45.5,35.21 44.8,35.88 47.23,40.71 48,40.21
  pour Top (rank 2): 2.7,1.11 2.7,7.51 4.4,7.51 4.4,41.31 2.5,43.21 2.5,50.61 3.8,50.61 3.8,55.41 19.4,55.41 19.4,54.91 23.1,54.91 23.1,42.91 19.8,42.91 19.8,43.41 18.5,43.41 18.5,41.66 27.5,41.66 27.5,57.71 42.9,57.71 45.5,55.11 47.3,55.11 47.8,54.61 47.8,40.75 52.5,38.11 52.5,62.61 -1.5,62.61 -1.5,1.11
  pour Top (rank 2): 27.55,44.11 arc-90 37.58,54.13 arc-90 47.5,44.21 47.5,43.46 48,43.46 48,54.61 arc90 47,55.61 46,55.61 arc-90 44.5,57.11 arc90 43.5,58.11 28,58.11 arc90 27.5,57.61 27.5,42.94
  pour Top (rank 3): 47.5,44.11 arc-90 37.65,34.26 37.65,33.11 46.6,33.11 46.6,37.76 51.55,37.76 51.55,44.11
  pour Top (rank 2): 38.85,34.31 38.85,20.76 40.1,19.51 40.1,12.51 40.75,12.51 40.75,16.91 41.1,17.26 41.1,24.56 41.65,25.11 41.6,25.11 40.75,25.96 40.75,33.26 46.65,33.26 46.65,35.61 42.95,35.61 41.65,34.31
  pour Top: 27.5,47.71 27.5,41.71 26.95,41.71 26.95,47.71
  pour Bottom: 44.5,34.91 44.5,38.38 47.12,41.01 48.33,41.01 48.33,40.09 45.83,37.59 45.83,34.91
VCC_SRAM  (via drill 0.35)
  Top 0.203: 7.97,32.29 SJ5.1 7.72,32.54 v7.19,32.54 | U3.28 19.33,30.48 19.22,30.96 19.81,31.56 v20.76,31.56 | 23.95,32.66 23.95,32.56 | 22.18,29.23 C5.1 | U2.24 7.2,51.11 7,51.11 | 5,48.61 C6.1 | U5.1 20,52.66 18.35,52.66 16.75,51.06 16.75,48.26 17.7,47.31 21.8,47.31 21.85,47.26 v21.85,44.81 21.64,44.59 U4.6 21.64,44.6 v21.84,44.81
  Bottom 0.203: v20.76,31.56 19.66,32.66 19.66,34.16 18.59,35.22 12.48,35.22 11.69,34.44 9.11,34.44 7.22,32.54 v7.19,32.54 | TP1.TP 21.7,47.11 22.65,46.16
  other vias: 21.84,45.81 21.84,46.81 22.64,36.51 23.64,36.51 24.64,36.51 14.25,48.86 14.25,47.86 6.25,48.86 6.25,47.86
  pour Top (rank 2): 4.2,53.36 4.2,50.61 4.6,50.61 4.6,47.76 3.05,47.76 3.05,46.36 7.5,46.36 7.5,53.36
  pour Top: 25,37.61 25,29.31 15.5,29.31 15.5,37.61
  pour Top: 20,54.76 21,54.76 21,51.86 19.75,51.86 19,51.11 18,51.11 18,49.86 18.75,49.11 19.75,49.11 20.9,47.96 22.4,47.96 22.5,47.86 22.5,46.66 22.7,46.46 22.7,43.26 21.55,43.26 21.55,46.76 13.5,46.76 13.5,49.11 16.5,52.11 16.5,52.76 20,52.76
  pour Bottom: 21.5,47.11 21.5,40.36 21,39.86 21,38.97 22.35,37.62 22.35,36.21 24.95,36.21 24.95,37.46 23.5,37.46 23.5,39.86 22.75,40.61 22.75,43.86 23.25,44.36 23.25,47.11
  pour Bottom: 14.55,49.16 5.95,49.16 5.95,47.56 14.55,47.56

### Text on the board
tPlace: 64K | SW1 | 256K | NO / REV | REV / A/B
tNames: + | CR2032 | MBC3 | - | CR2025 | U4 | EEPROM | SRAM | 29F016 / 29F032 / 29F033 | 62256 / 6264
tStop: GAME BOY MBC3 CARTRIDGE | 1 | 32
bStop: v1.3 | www.mousebitelabs.com | SUPPORT ORIGINAL CREATORS!